# Altium project pcb_kart.PrjPcb
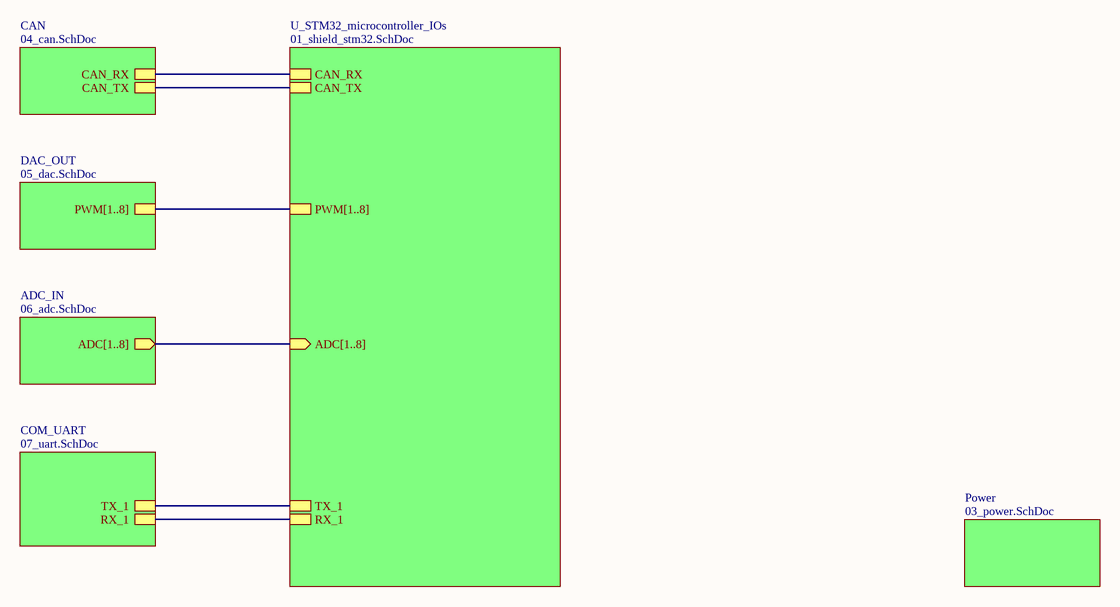
[diagram p0: 00_top.SchDoc]
9 sheets, 191 parts. Net scope: hierarchical (ports join the sheet entries above them; power ports are global).
Board files: PCB.PcbDoc, shield_kart.PcbDoc
Sheets:
  00_top.SchDoc
    U_STM32_microcontroller_IOs = 01_shield_stm32.SchDoc
    Power = 03_power.SchDoc
    CAN = 04_can.SchDoc
    DAC_OUT = 05_dac.SchDoc
      OPTO1 = opto.SchDoc
      OPTO2 = opto.SchDoc
      OPTO3 = opto.SchDoc
      OPTO4 = opto.SchDoc
      OPTO5 = opto.SchDoc
      OPTO6 = opto.SchDoc
      OPTO7 = opto.SchDoc
      OPTO8 = opto.SchDoc
      FILTER1 = low_filter.SchDoc
      FILTER2 = low_filter.SchDoc
      FILTER3 = low_filter.SchDoc
      FILTER4 = low_filter.SchDoc
      FILTER5 = low_filter.SchDoc
      FILTER6 = low_filter.SchDoc
      FILTER7 = low_filter.SchDoc
      FILTER8 = low_filter.SchDoc
    ADC_IN = 06_adc.SchDoc
      OPTO1 = opto.SchDoc
      OPTO2 = opto.SchDoc
      OPTO3 = opto.SchDoc
      OPTO4 = opto.SchDoc
      OPTO5 = opto.SchDoc
      OPTO6 = opto.SchDoc
      OPTO7 = opto.SchDoc
      OPTO8 = opto.SchDoc
      FILTER1 = low_filter.SchDoc
      FILTER2 = low_filter.SchDoc
      FILTER3 = low_filter.SchDoc
      FILTER4 = low_filter.SchDoc
      FILTER5 = low_filter.SchDoc
      FILTER6 = low_filter.SchDoc
      FILTER7 = low_filter.SchDoc
      FILTER8 = low_filter.SchDoc
    COM_UART = 07_uart.SchDoc

## Sheet 00_top.SchDoc: KART : Top
size A4; DrawnBy: JNieto; DocumentNumber: 1; Revision: 1.0; SheetNumber: 1; SheetTotal: 10; Version: V 1.0.0

### Sub-sheets
ADC_IN = 06_adc.SchDoc: ADC[1..8] (out)
CAN = 04_can.SchDoc: CAN_RX, CAN_TX
COM_UART = 07_uart.SchDoc: TX_1, RX_1
DAC_OUT = 05_dac.SchDoc: PWM[1..8]
Power = 03_power.SchDoc: no entries
U_STM32_microcontroller_IOs = 01_shield_stm32.SchDoc: CAN_RX, CAN_TX, PWM[1..8], ADC[1..8] (in), TX_1, RX_1

### Nets
GPS_RX: sheet U_STM32_microcontroller_IOs/RX_1, sheet COM_UART/RX_1
GPS_TX: sheet U_STM32_microcontroller_IOs/TX_1, sheet COM_UART/TX_1
PD0: sheet U_STM32_microcontroller_IOs/CAN_RX, sheet CAN/CAN_RX
PD1: sheet U_STM32_microcontroller_IOs/CAN_TX, sheet CAN/CAN_TX

### Buses and harness runs
bus sheet ADC_IN/ADC[1..8] = sheet U_STM32_microcontroller_IOs/ADC[1..8]
bus sheet DAC_OUT/PWM[1..8] = sheet U_STM32_microcontroller_IOs/PWM[1..8]

## Sheet 01_shield_stm32.SchDoc: KART : SHIELD STM32
size A4; DrawnBy: JNieto; DocumentNumber: 2; Revision: 1.0; SheetNumber: 2; SheetTotal: 10; Version: V 1.0.0
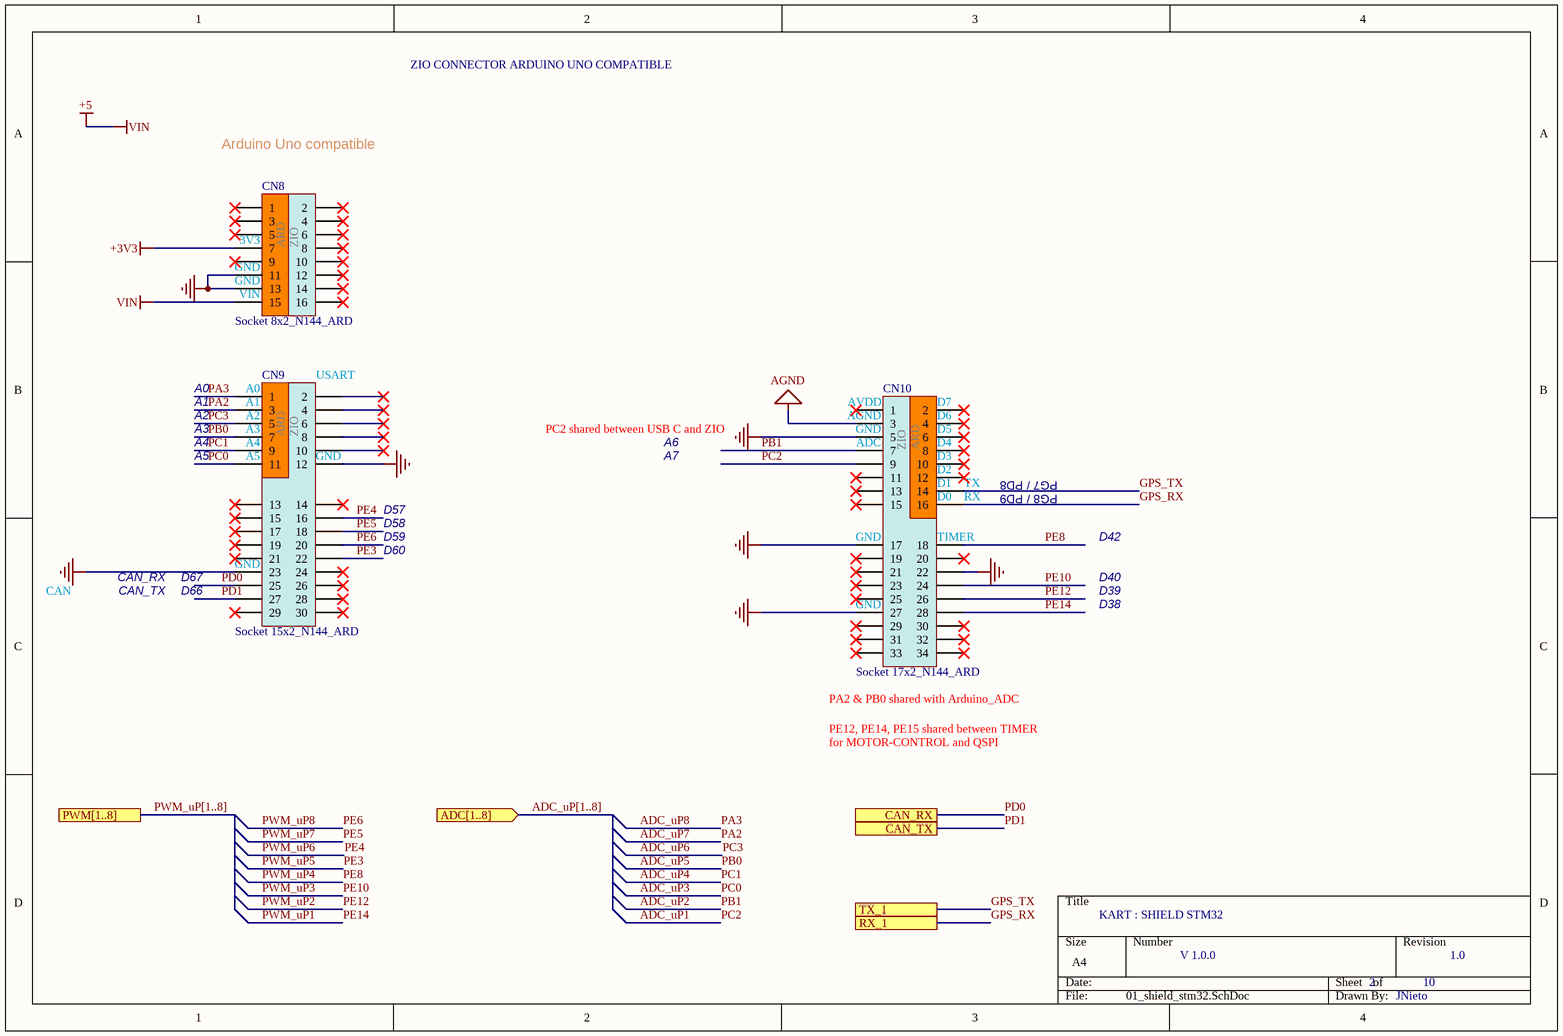
[diagram p1: 01_shield_stm32.SchDoc]

### Parts
CN8  value Socket 8x2_N144_ARD  [CON_SAMTEC_SSW-108-23-X-D_N144_ARD]
CN9  value Socket 15x2_N144_ARD  [CON_SAMTEC_SSW-115-23-X-D_N144_ARD]
CN10  value Socket 17x2_N144_ARD  [CON_SAMTEC_SSW-117-23-X-D_N144_ARD]

### Ports
ADC[1..8] (in), CAN_RX, CAN_TX, PWM[1..8], RX_1, TX_1

### Nets
+3V3: CN8.7
+5: CN8.15  [also labelled VIN]
AGND: CN10.3
GND: CN8.11 CN8.13 CN9.12 CN9.23 CN10.5 CN10.17 CN10.22 CN10.27
ADC_uP1: CN10.9  [also labelled PC2]  [project net ADC_OUT1]
ADC_uP2: CN10.7  [also labelled PB1]  [project net ADC_OUT2]
ADC_uP3: CN9.11  [also labelled PC0]  [project net ADC_OUT3]
ADC_uP4: CN9.9  [also labelled PC1]  [project net ADC_OUT4]
ADC_uP5: CN9.7  [also labelled PB0]  [project net ADC_OUT5]
ADC_uP6: CN9.5  [also labelled PC3]  [project net ADC_OUT6]
ADC_uP7: CN9.3  [also labelled PA2]  [project net ADC_OUT7]
ADC_uP8: CN9.1  [also labelled PA3]  [project net ADC_OUT8]
GPS_RX: CN10.16 ; port RX_1
GPS_TX: CN10.14 ; port TX_1
PD0: CN9.25 ; port CAN_RX
PD1: CN9.27 ; port CAN_TX
PE3: CN9.22  [also labelled PWM_uP5]
PE4: CN9.16  [also labelled PWM_uP6]
PE5: CN9.18  [also labelled PWM_uP7]
PE6: CN9.20  [also labelled PWM_uP8]
PE8: CN10.18  [also labelled PWM_uP4]
PE10: CN10.24  [also labelled PWM_uP3]
PE12: CN10.26  [also labelled PWM_uP2]
PE14: CN10.28  [also labelled PWM_uP1]

Not connected (* = marked no-connect by the designer): CN8 1* 2* 3* 4* 5* 6* 8* 9* 10* 12* 14* 16*; CN9 2* 4* 6* 8* 10* 13* 14* 15* 17* 19* 21* 24* 26* 28* 29* 30*; CN10 1* 2* 4* 6* 8* 10* 11* 12* 13* 15* 19* 20* 21* 23* 25* 29* 30* 31* 32* 33* 34*

### Buses and harness runs
bus ADC_uP[1..8] = port ADC[1..8]
bus PWM_uP[1..8] = port PWM[1..8]

### Notes on the sheet
- ZIO CONNECTOR ARDUINO UNO COMPATIBLE
- Arduino Uno compatible
- (near CN8) 3V3
- (near CN8) GND
- (near CN8) VIN
- (near CN9) USART
- A0
- A1
- A2
- A3
- A4
- (near CN9) A0
- (near CN9) A1
- (near CN9) A2
- (near CN9) A3
- (near CN9) A4
- PC2 shared between USB C and ZIO
- A6
- (near CN10) GND
- (near CN10) AVDD
- (near CN10) AGND
- (near CN10) ADC
- (near CN10) D7
- (near CN10) D6
- (near CN10) D5
- (near CN10) D4
- A5
- (near CN9) A5
- (near CN9) GND
- D57
- A7
- (near CN10) D2
- (near CN10) D3
- (near CN10) D1
- (near CN10) D0
- (near CN10) TX
- (near CN10) RX
- PG8 / PD9
- PG7 / PD8
- CAN_RX
- D67
- D58
- D59
- D60
- (near CN10) TIMER
- D40
- D42
- CAN
- CAN_TX
- D66
- D38
- D39
- (near CN10) PA2 & PB0 shared with Arduino_ADC
- PE12, PE14, PE15 shared between TIMER for MOTOR-CONTROL and QSPI
- (in symbol MCD-01037) ARD; ZIO
- (in symbol MCD-01040) ARD; ZIO
- (in symbol MCD-01041) ZIO; ARD

### Library data of the parts
CN8 = MCD-01037: Socket, 8x2, 2.54mm, VR, TH, Height 8.51mm/10mm, Low insertion force.; Part_Type: Connector; Manufacturer_Part_Number: SSW-108-23-x-D; Manufacturer: SAMTEC; Provided_By: Subcon; Initial_Board_Reference: MB1361; Remark: Socket dedicated to Arduino+ZIO connector on NUCLEO144; Internal_Part_Number: MCD-01037; Status: Checked; ComponentLink1Description: Datasheet; ComponentLink1URL: http://tunmcdsvn.tun.st.com/Component_Datasheet_Library/Trunk/Connectors/Samtec_SSW-SSQ-series; ECCN_US: n/a; ECCN_EU: n/a
CN9 = MCD-01040: Socket, 15x2, 2.54mm, VR, TH, Height 8.51mm/10mm, Low insertion force.; Part_Type: Connector; Manufacturer_Part_Number: SSW-115-23-x-D; Manufacturer: SAMTEC; Provided_By: Subcon; Initial_Board_Reference: MB1361; Remark: Socket dedicated to Arduino+ZIO connector on NUCLEO144; Internal_Part_Number: MCD-01040; Status: Checked; ComponentLink1Description: Datasheet; ComponentLink1URL: http://tunmcdsvn.tun.st.com/Component_Datasheet_Library/Trunk/Connectors/Samtec_SSW-SSQ-series; ECCN_US: n/a; ECCN_EU: n/a
CN10 = MCD-01041: Socket, 17x2, 2.54mm, VR, TH, Height 8.51mm/10mm, Low insertion force; Part_Type: Connector; Manufacturer_Part_Number: SSW-117-23-x-D; Manufacturer: SAMTEC; Provided_By: Subcon; Initial_Board_Reference: MB1361; Remark: Socket dedicated to Arduino+ZIO connector on NUCLEO144; Internal_Part_Number: MCD-01041; Status: Checked; ComponentLink1Description: Datasheet; ComponentLink1URL: http://tunmcdsvn.tun.st.com/Component_Datasheet_Library/Trunk/Connectors/Samtec_SSW-SSQ-series; ECCN_US: n/a; ECCN_EU: n/a

## Sheet 03_power.SchDoc: KART : POWER
size A4; DrawnBy: JNieto; DocumentNumber: 4; Revision: 1.0; SheetNumber: 4; SheetTotal: 10; Version: V 1.0.0
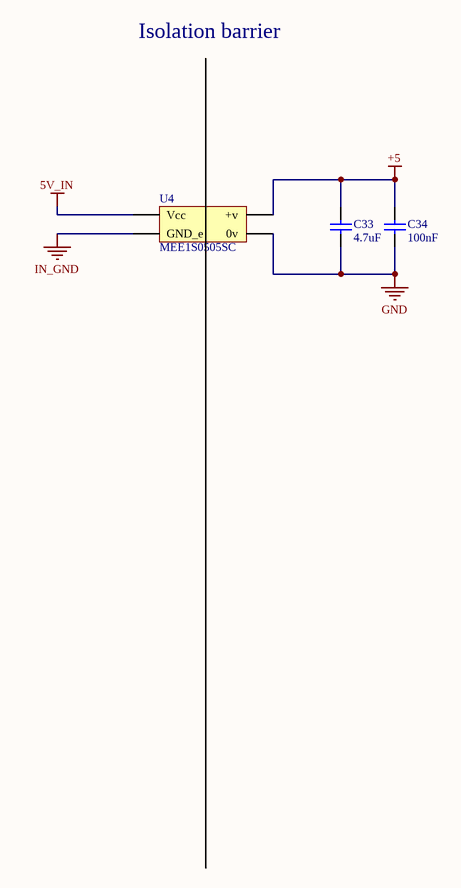
[diagram p2: 03_power.SchDoc]

### Parts
C33  value 4.7uF  [C0402]
C34  value 100nF  [C0603]  (hidden comment: Capacitor)
U4  MEE1S0505SC  [DCDC]

### Nets
5V_IN: U4.2(Vcc)
+5: C33.2 C34.2 U4.4(+v)
GND: C33.1 C34.1 U4.3(0v)
IN_GND: U4.1(GND_e)

### Notes on the sheet
- Isolation barrier

### Library data of the parts
C33 = MCD-01356: Capacitor, MLCC, 4.7uF, 6V3, X5R, 20%, 0402, T=0,5mm; Manufacturer_Part_Number: GRM155R60J475ME47; Manufacturer: MURATA; ECCN_US: EAR99; ECCN_EU: NEC; Provided_By: Subcon; Initial_Board_Reference: MB1372; Internal_Part_Number: MCD-01356; Status: Checked; Part_Type: Capacitor; Package: C0402; ComponentLink1Description: Datasheet; ComponentLink1URL: http://tunmcdsvn.tun.st.com/Component_Datasheet_Library/Trunk/Capacitors/Murata_Capacitor_GR_series
C34 = MCD-00102: Capacitor, MLCC, 100nF, 16V, X7R, 10%, 0402, T=0,5mm; Manufacturer_Part_Number: CC0402KRX7R7BB104; Manufacturer: YAGEO; Alternate_Manufacturer_Part_Number: GCM155R71C104KA55D; Alternate_Manufacturer: MURATA; Provided_By: SUBCO; Internal_Part_Number: MCD-00102; Status: Released; Part_Type: Capacitor; Package: C0402; ComponentLink1Description: Datasheet; ComponentLink1URL: http://tunmcdsvn.tun.st.com/Component_Datasheet_Library/Trunk/Capacitors/Yageo_Multilayer_Capacitor_X7R_series_100pF_to_22uF
U4 = DCDC

## Sheet 04_can.SchDoc: KART : CAN
size A4; DrawnBy: JNieto; DocumentNumber: 4; Revision: 1.0; SheetNumber: 5; SheetTotal: 10; Version: V 1.0.0
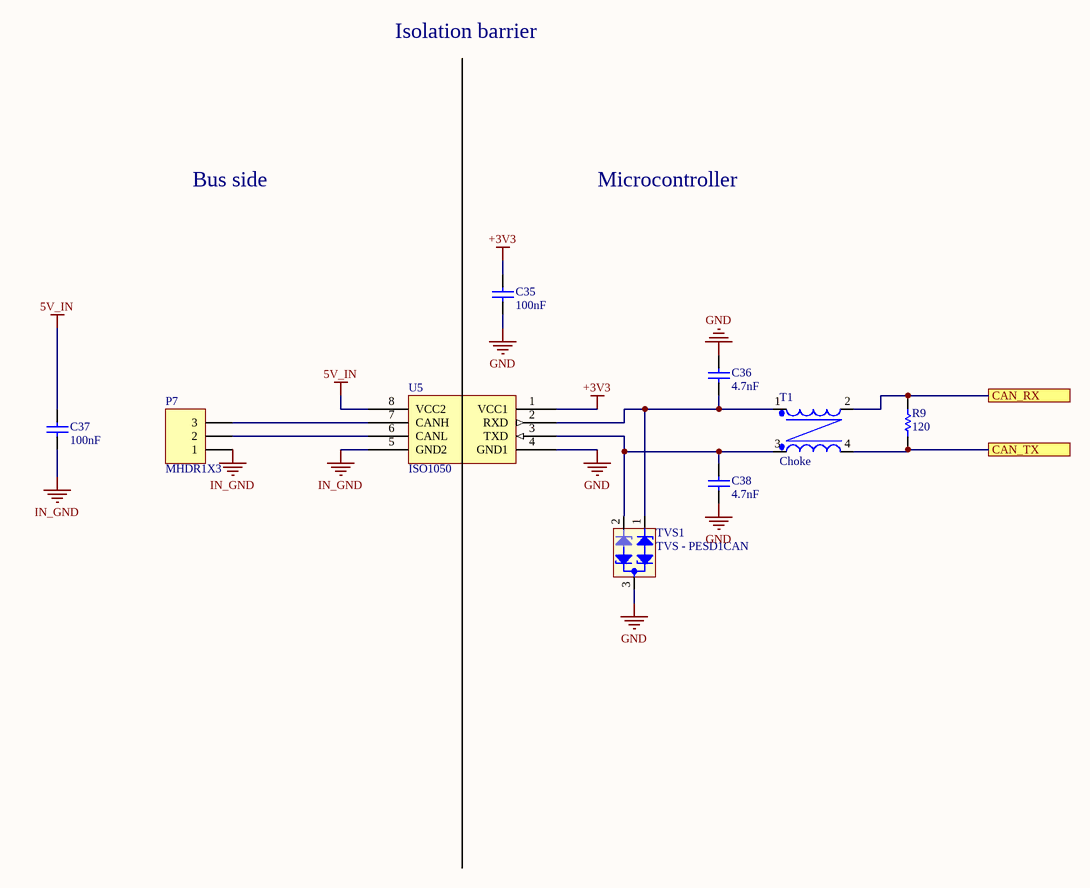
[diagram p3: 04_can.SchDoc]

### Parts
C35  value 100nF  [C0603]  (hidden comment: Capacitor)
C36  value 4.7nF  [C0603]  (hidden comment: Capacitor)
C37  value 100nF  [C0603]  (hidden comment: Capacitor)
C38  value 4.7nF  [C0603]  (hidden comment: Capacitor)
P7  MHDR1X3  [MHDR1X3]
R9  value 120  [R0603]
T1  Choke  [Choke 744232601 Wurth - Footprint Fabricante]
TVS1  TVS - PESD1CAN  [SOT23A]
U5  ISO1050  [ISO1050]

### Ports
CAN_RX, CAN_TX

### Nets
5V_IN: C37.2 U5.8(VCC2)
+3V3: C35.2 U5.1(VCC1)
GND: C35.1 C36.2 C38.1 TVS1.3(Common_Cathode) U5.4(GND1)
IN_GND: C37.1 P7.1 U5.5(GND2)
PD0: R9.1 T1.2(Sec+) ; port CAN_RX
PD1: R9.2 T1.4(Sec-) ; port CAN_TX
NetC36_1: C36.1 T1.1(Pri+) TVS1.1(Cathode) U5.2(RXD)
NetC38_2: C38.2 T1.3(Pri-) TVS1.2(Cathode) U5.3(TXD)
NetP7_2: P7.2 U5.6(CANL)
NetP7_3: P7.3 U5.7(CANH)

### Notes on the sheet
- Isolation barrier
- Bus side
- Microcontroller

### Library data of the parts
C35 C37 = MCD-00010: Capacitor, MLCC, 100nF, 16V, X5R, 10%, 0603, T=0,8mm; Manufacturer_Part_Number: CC0603KRX5R7BB105; Manufacturer: YAGEO; Provided_By: SUBCO; Internal_Part_Number: MCD-00010; Status: Released; Part_Type: Capacitor; Package: C0603; ComponentLink1Description: Datasheet; ComponentLink1URL: http://tunmcdsvn.tun.st.com/Component_Datasheet_Library/Trunk/Capacitors/Yageo_Multilayer_capacitor_X5R_series_100pF_to_100uF
C36 C38 = MCD-00102: Capacitor, MLCC, 4.7nF, 16V, X7R, 10%, 0402, T=0,5mm; Manufacturer_Part_Number: CC0402KRX7R7BB104; Manufacturer: YAGEO; Alternate_Manufacturer_Part_Number: GCM155R71C104KA55D; Alternate_Manufacturer: MURATA; Provided_By: SUBCO; Internal_Part_Number: MCD-00102; Status: Released; Part_Type: Capacitor; Package: C0402; ComponentLink1Description: Datasheet; ComponentLink1URL: http://tunmcdsvn.tun.st.com/Component_Datasheet_Library/Trunk/Capacitors/Yageo_Multilayer_Capacitor_X7R_series_100pF_to_22uF
P7 = MHDR1X3: Header, 3-Pin; LatestRevisionDate: 17-Jul-2002; LatestRevisionNote: Re-released for DXP Platform.; Publisher: Altium Limited
R9 = MCD-00220: Resistor,120,0603,1%,1/10W; Manufacturer_Part_Number: RC0603FR-0710KL; Manufacturer: YAGEO; Provided_By: Subcon; Initial_Board_Reference: MB1319; Internal_Part_Number: MCD-00220; Status: Released; Part_Type: Resistor; ComponentLink1Description: Datasheet; ECCN_US: n/a; ECCN_EU: n/a; Package: R0603; ComponentLink1URL: http://tunmcdsvn.tun.st.com/Component_Datasheet_Library/Trunk/Resistors/Yageo_Resistor_RC0603-series
T1 = Choke_1: Choke modo comun; Dist. 1: FARNELL; Dist. 1 Codigo: 1636477
TVS1 = TVS - PESD1CAN: CAN bus ESD protection diode; Dist. 1 Codigo: 1510703; Dist. 1: FARNELL
U5 = ISO1050: CAN Transceiver, Isolated, Vcc1 - 3 to 5V, Vcc2 - 5V; Precio: 4.09; Dist. 1: Farnell; Dist. 1 Codigo: 1755712; Codigo fabricante: ISO1050DUBR; Comentario: IC, CAN TRANSCEIVER, ISOLATED, 5V

## Sheet 05_dac.SchDoc: KART : DAC
size A4; DrawnBy: JNieto; DocumentNumber: 4; Revision: 1.0; SheetNumber: 8; SheetTotal: 10; Version: V 1.0.0
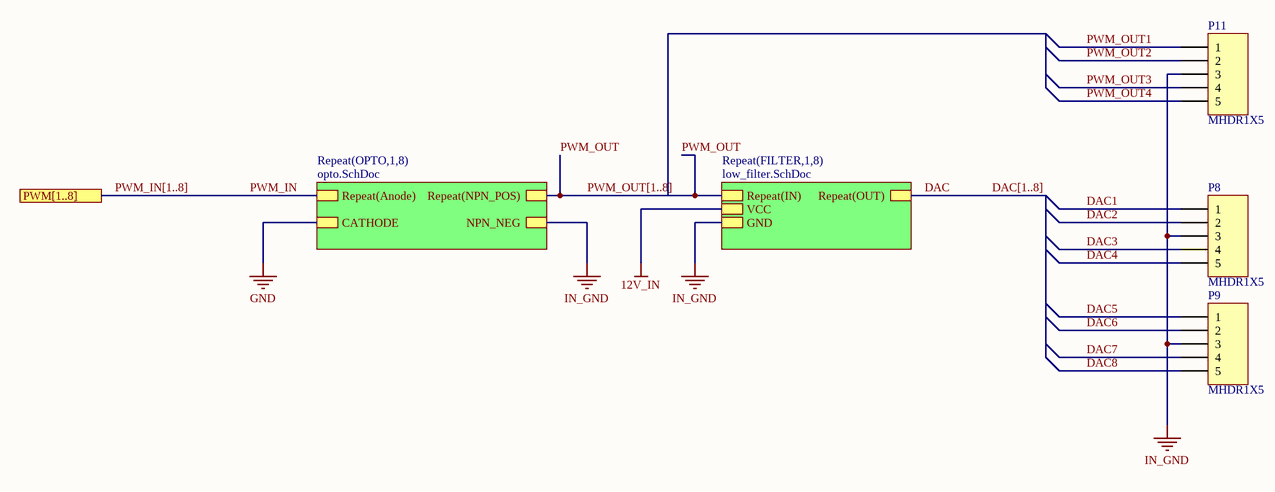
[diagram p4: 05_dac.SchDoc]

### Parts
P8  MHDR1X5  [MHDR1X5]
P9  MHDR1X5  [MHDR1X5]
P11  MHDR1X5  [MHDR1X5]

### Sub-sheets
Repeat(FILTER,1,8) = low_filter.SchDoc: VCC, GND, Repeat(IN), Repeat(OUT)
Repeat(OPTO,1,8) = opto.SchDoc: NPN_NEG, Repeat(NPN_POS), CATHODE, Repeat(Anode)

### Ports
PWM[1..8]

### Nets
IN_GND: P8.3 P9.3 P11.3 ; sheet Repeat(OPTO,1,8)/NPN_NEG, sheet Repeat(FILTER,1,8)/GND
DAC: sheet Repeat(FILTER,1,8)/Repeat(OUT)
DAC1: P8.1
DAC2: P8.2
DAC3: P8.4
DAC4: P8.5
DAC5: P9.1
DAC6: P9.2
DAC7: P9.4
DAC8: P9.5
PWM_IN: sheet Repeat(OPTO,1,8)/Repeat(Anode)
PWM_OUT: sheet Repeat(OPTO,1,8)/Repeat(NPN_POS), sheet Repeat(FILTER,1,8)/Repeat(IN)  [also labelled PWM_OUT[1..8]]
PWM_OUT1: P11.1  [also labelled PWM_OUT[1..8]1]
PWM_OUT2: P11.2  [also labelled PWM_OUT[1..8]2]
PWM_OUT3: P11.4  [also labelled PWM_OUT[1..8]3]
PWM_OUT4: P11.5  [also labelled PWM_OUT[1..8]4]

### Buses and harness runs
bus DAC[1..8]
bus PWM_IN[1..8] = port PWM[1..8]

### Library data of the parts
P8 P9 P11 = MHDR1X5: Header, 5-Pin; LatestRevisionDate: 17-Jul-2002; LatestRevisionNote: Re-released for DXP Platform.; Publisher: Altium Limited

## Sheet opto.SchDoc: KART : FILTER
size A4; DrawnBy: JNieto; DocumentNumber: 4; Revision: 1.0; SheetNumber: 9; SheetTotal: 10; Version: V 1.0.0
Used 16 times, as channels DAC_OUT/OPTO1, DAC_OUT/OPTO2, DAC_OUT/OPTO3, DAC_OUT/OPTO4, DAC_OUT/OPTO5, DAC_OUT/OPTO6, DAC_OUT/OPTO7, DAC_OUT/OPTO8, ADC_IN/OPTO1, ADC_IN/OPTO2, ADC_IN/OPTO3, ADC_IN/OPTO4, ADC_IN/OPTO5, ADC_IN/OPTO6, ADC_IN/OPTO7, ADC_IN/OPTO8. Parts and nets are listed once, with the designators drawn on the sheet.
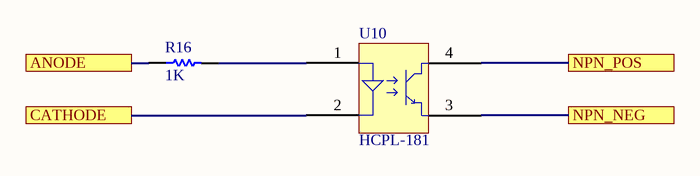
[diagram p5: opto.SchDoc]

### Parts
R16  value 1K  [R0603]
U10  HCPL-181  [SOIC-4]

### Ports
ANODE, CATHODE, NPN_NEG, NPN_POS

### Nets
ANODE: R16.1 ; port ANODE
CATHODE: U10.2 ; port CATHODE
NPN_NEG: U10.3 ; port NPN_NEG
NPN_POS: U10.4 ; port NPN_POS
NetR16_2: R16.2 U10.1

### Channels
DAC_OUT/OPTO1: designators end in _1; ports ANODE=PE14 CATHODE=GND NPN_NEG=IN_GND NPN_POS=PWM_OUT1
DAC_OUT/OPTO2: designators end in _2; ports ANODE=PE12 CATHODE=GND NPN_NEG=IN_GND NPN_POS=PWM_OUT2
DAC_OUT/OPTO3: designators end in _3; ports ANODE=PE10 CATHODE=GND NPN_NEG=IN_GND NPN_POS=PWM_OUT3
DAC_OUT/OPTO4: designators end in _4; ports ANODE=PE8 CATHODE=GND NPN_NEG=IN_GND NPN_POS=PWM_OUT4
DAC_OUT/OPTO5: designators end in _5; ports ANODE=PE3 CATHODE=GND NPN_NEG=IN_GND NPN_POS=PWM_OUT5
DAC_OUT/OPTO6: designators end in _6; ports ANODE=PE4 CATHODE=GND NPN_NEG=IN_GND NPN_POS=PWM_OUT6
DAC_OUT/OPTO7: designators end in _7; ports ANODE=PE5 CATHODE=GND NPN_NEG=IN_GND NPN_POS=PWM_OUT7
DAC_OUT/OPTO8: designators end in _8; ports ANODE=PE6 CATHODE=GND NPN_NEG=IN_GND NPN_POS=PWM_OUT8
ADC_IN/OPTO1: designators end in _9; ports ANODE=ADC1 CATHODE=IN_GND NPN_NEG=AGND NPN_POS=ADC_IN1
ADC_IN/OPTO2: designators end in _10; ports ANODE=ADC2 CATHODE=IN_GND NPN_NEG=AGND NPN_POS=ADC_IN2
ADC_IN/OPTO3: designators end in _11; ports ANODE=ADC3 CATHODE=IN_GND NPN_NEG=AGND NPN_POS=ADC_IN3
ADC_IN/OPTO4: designators end in _12; ports ANODE=ADC4 CATHODE=IN_GND NPN_NEG=AGND NPN_POS=ADC_IN4
ADC_IN/OPTO5: designators end in _13; ports ANODE=ADC5 CATHODE=IN_GND NPN_NEG=AGND NPN_POS=ADC_IN5
ADC_IN/OPTO6: designators end in _14; ports ANODE=ADC6 CATHODE=IN_GND NPN_NEG=AGND NPN_POS=ADC_IN6
ADC_IN/OPTO7: designators end in _15; ports ANODE=ADC7 CATHODE=IN_GND NPN_NEG=AGND NPN_POS=ADC_IN7
ADC_IN/OPTO8: designators end in _16; ports ANODE=ADC8 CATHODE=IN_GND NPN_NEG=AGND NPN_POS=ADC_IN8

### Library data of the parts
R16 = MCD-00220: Resistor,1K,0603,1%,1/10W; Manufacturer_Part_Number: RC0603FR-0710KL; Manufacturer: YAGEO; Provided_By: Subcon; Initial_Board_Reference: MB1319; Internal_Part_Number: MCD-00220; Status: Released; Part_Type: Resistor; ComponentLink1Description: Datasheet; ECCN_US: n/a; ECCN_EU: n/a; Package: R0603; ComponentLink1URL: http://tunmcdsvn.tun.st.com/Component_Datasheet_Library/Trunk/Resistors/Yageo_Resistor_RC0603-series
U10 = HCPL-181: Optoacoplador

## Sheet low_filter.SchDoc: KART : LOW FILTER
size A4; DrawnBy: JNieto; DocumentNumber: 4; Revision: 1.0; SheetNumber: 7; SheetTotal: 10; Version: V 1.0.0
Used 16 times, as channels DAC_OUT/FILTER1, DAC_OUT/FILTER2, DAC_OUT/FILTER3, DAC_OUT/FILTER4, DAC_OUT/FILTER5, DAC_OUT/FILTER6, DAC_OUT/FILTER7, DAC_OUT/FILTER8, ADC_IN/FILTER1, ADC_IN/FILTER2, ADC_IN/FILTER3, ADC_IN/FILTER4, ADC_IN/FILTER5, ADC_IN/FILTER6, ADC_IN/FILTER7, ADC_IN/FILTER8. Parts and nets are listed once, with the designators drawn on the sheet.
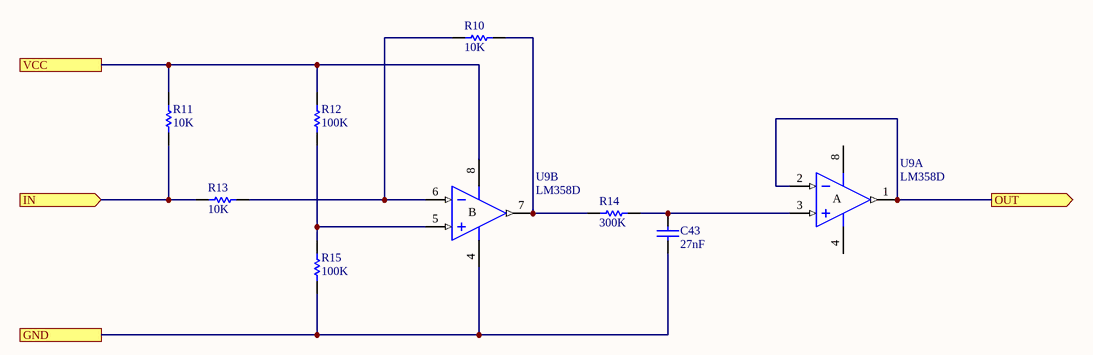
[diagram p6: low_filter.SchDoc]

### Parts
C43  value 27nF  [C0603]
R10  value 10K  [R0603]
R11  value 10K  [R0603]
R12  value 100K  [R0603]
R13  value 10K  [R0603]
R14  value 300K  [R0603]
R15  value 100K  [R0603]
U9  LM358D  [SO8_N]  (parts A,B of 2)

### Ports
GND, IN (in), OUT (out), VCC

### Nets
GND: C43.1 R15.2 U9.4(V-) ; port GND
IN: R11.2 R13.1 ; port IN
OUT: U9.1(OUT) U9.2(IN-) ; port OUT
VCC: R11.1 R12.1 U9.8(V+) ; port VCC
NetC43_2: C43.2 R14.2 U9.3(IN+)
NetR10_1: R10.1 R13.2 U9.6(IN-)
NetR10_2: R10.2 R14.1 U9.7(OUT)
NetR12_2: R12.2 R15.1 U9.5(IN+)

### Channels
DAC_OUT/FILTER1: designators end in _1; ports GND=IN_GND IN=PWM_OUT1 OUT=DAC1 VCC=12V_IN
DAC_OUT/FILTER2: designators end in _2; ports GND=IN_GND IN=PWM_OUT2 OUT=DAC2 VCC=12V_IN
DAC_OUT/FILTER3: designators end in _3; ports GND=IN_GND IN=PWM_OUT3 OUT=DAC3 VCC=12V_IN
DAC_OUT/FILTER4: designators end in _4; ports GND=IN_GND IN=PWM_OUT4 OUT=DAC4 VCC=12V_IN
DAC_OUT/FILTER5: designators end in _5; ports GND=IN_GND IN=PWM_OUT5 OUT=DAC5 VCC=12V_IN
DAC_OUT/FILTER6: designators end in _6; ports GND=IN_GND IN=PWM_OUT6 OUT=DAC6 VCC=12V_IN
DAC_OUT/FILTER7: designators end in _7; ports GND=IN_GND IN=PWM_OUT7 OUT=DAC7 VCC=12V_IN
DAC_OUT/FILTER8: designators end in _8; ports GND=IN_GND IN=PWM_OUT8 OUT=DAC8 VCC=12V_IN
ADC_IN/FILTER1: designators end in _9; ports GND=AGND IN=ADC_IN1 OUT=ADC_OUT1 VCC=+3V3
ADC_IN/FILTER2: designators end in _10; ports GND=AGND IN=ADC_IN2 OUT=ADC_OUT2 VCC=+3V3
ADC_IN/FILTER3: designators end in _11; ports GND=AGND IN=ADC_IN3 OUT=ADC_OUT3 VCC=+3V3
ADC_IN/FILTER4: designators end in _12; ports GND=AGND IN=ADC_IN4 OUT=ADC_OUT4 VCC=+3V3
ADC_IN/FILTER5: designators end in _13; ports GND=AGND IN=ADC_IN5 OUT=ADC_OUT5 VCC=+3V3
ADC_IN/FILTER6: designators end in _14; ports GND=AGND IN=ADC_IN6 OUT=ADC_OUT6 VCC=+3V3
ADC_IN/FILTER7: designators end in _15; ports GND=AGND IN=ADC_IN7 OUT=ADC_OUT7 VCC=+3V3
ADC_IN/FILTER8: designators end in _16; ports GND=AGND IN=ADC_IN8 OUT=ADC_OUT8 VCC=+3V3

### Notes on the sheet
- (in symbol LM358D, part A) A
- (in symbol LM358D, part B) B

### Library data of the parts
C43 = MCD-00211: Capacitor, MLCC, 27nF, 16V, X7R, 10%, 0603, T=0,8mm; Manufacturer_Part_Number: CC0603KRX7R7BB104; Manufacturer: YAGEO; Provided_By: Subcon; Initial_Board_Reference: MB1319; Internal_Part_Number: MCD-00211; ECCN_US: n/a; ECCN_EU: n/a; ComponentLink1Description: Datasheet; Status: Released; Part_Type: Capacitor; Package: C0603; ComponentLink1URL: http://tunmcdsvn.tun.st.com/Component_Datasheet_Library/Trunk/Capacitors/Yageo_Multilayer_Capacitor_X7R_series_100pF_to_22uF
R10 R11 R13 = MCD-00220: Resistor,10K,0603,1%,1/10W; Manufacturer_Part_Number: RC0603FR-0710KL; Manufacturer: YAGEO; Provided_By: Subcon; Initial_Board_Reference: MB1319; Internal_Part_Number: MCD-00220; Status: Released; Part_Type: Resistor; ComponentLink1Description: Datasheet; ECCN_US: n/a; ECCN_EU: n/a; Package: R0603; ComponentLink1URL: http://tunmcdsvn.tun.st.com/Component_Datasheet_Library/Trunk/Resistors/Yageo_Resistor_RC0603-series
R12 R15 = MCD-00220: Resistor,100K,0603,1%,1/10W; Manufacturer_Part_Number: RC0603FR-0710KL; Manufacturer: YAGEO; Provided_By: Subcon; Initial_Board_Reference: MB1319; Internal_Part_Number: MCD-00220; Status: Released; Part_Type: Resistor; ComponentLink1Description: Datasheet; ECCN_US: n/a; ECCN_EU: n/a; Package: R0603; ComponentLink1URL: http://tunmcdsvn.tun.st.com/Component_Datasheet_Library/Trunk/Resistors/Yageo_Resistor_RC0603-series
R14 = MCD-00220: Resistor,300K,0603,1%,1/10W; Manufacturer_Part_Number: RC0603FR-0710KL; Manufacturer: YAGEO; Provided_By: Subcon; Initial_Board_Reference: MB1319; Internal_Part_Number: MCD-00220; Status: Released; Part_Type: Resistor; ComponentLink1Description: Datasheet; ECCN_US: n/a; ECCN_EU: n/a; Package: R0603; ComponentLink1URL: http://tunmcdsvn.tun.st.com/Component_Datasheet_Library/Trunk/Resistors/Yageo_Resistor_RC0603-series
U9 = LM358D: Dual Low-Power Operational Amplifier; Published: 24-Aug-2001; LatestRevisionDate: 13-Apr-2006; LatestRevisionNote: IPC-7351 Footprint Added.; PackageVersion: Dec-2002; PackageReference: SO8; Publisher: Altium Limited; PackageDescription: 8-Pin Small Outline Integrated Circuit 1.27 mm Pitch; Code_JEDEC: MS-012-AA; Code_IPC: SOIC127P600-8; ComponentLink1Description: Manufacturer Link; ComponentLink1URL: http://www.st.com/; ComponentLink2Description: Datasheet; ComponentLink2URL: http://www.st.com/stonline/products/literature/ds/2163/lm358.pdf

## Sheet 06_adc.SchDoc: KART : ADC
size A4; DrawnBy: JNieto; DocumentNumber: 4; Revision: 1.0; SheetNumber: 6; SheetTotal: 10; Version: V 1.0.0
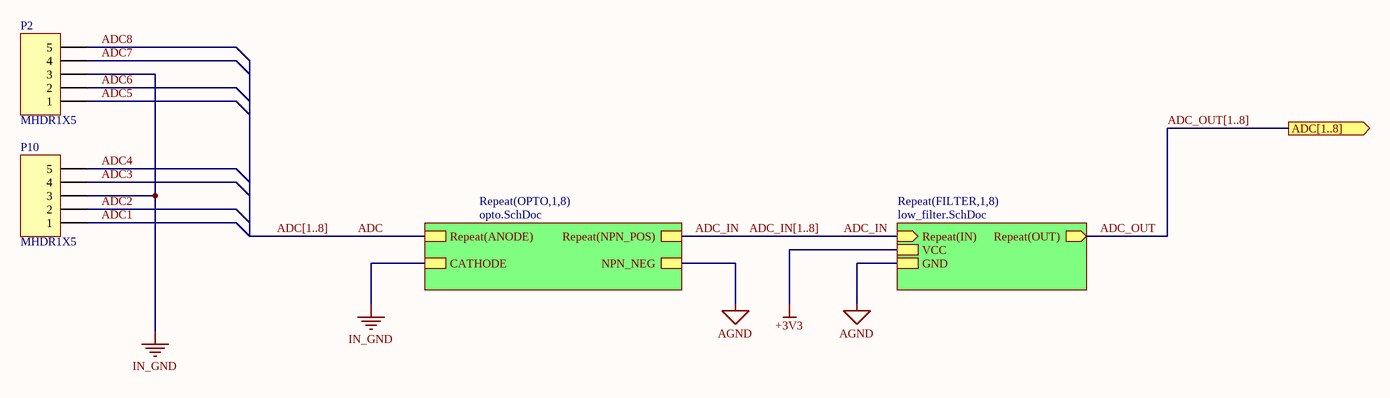
[diagram p7: 06_adc.SchDoc]

### Parts
P2  MHDR1X5  [MHDR1X5]
P10  MHDR1X5  [MHDR1X5]

### Sub-sheets
Repeat(FILTER,1,8) = low_filter.SchDoc: VCC, GND, Repeat(IN) (in), Repeat(OUT) (out)
Repeat(OPTO,1,8) = opto.SchDoc: NPN_NEG, Repeat(NPN_POS), CATHODE, Repeat(ANODE)

### Ports
ADC[1..8] (out)

### Nets
AGND: sheet Repeat(OPTO,1,8)/NPN_NEG, sheet Repeat(FILTER,1,8)/GND
IN_GND: P2.3 P10.3 ; sheet Repeat(OPTO,1,8)/CATHODE
ADC: sheet Repeat(OPTO,1,8)/Repeat(ANODE)
ADC1: P10.1
ADC2: P10.2
ADC3: P10.4
ADC4: P10.5
ADC5: P2.1
ADC6: P2.2
ADC7: P2.4
ADC8: P2.5
ADC_IN: sheet Repeat(OPTO,1,8)/Repeat(NPN_POS), sheet Repeat(FILTER,1,8)/Repeat(IN)
ADC_OUT: sheet Repeat(FILTER,1,8)/Repeat(OUT)

### Buses and harness runs
bus ADC[1..8]
bus ADC_IN[1..8]
bus ADC_OUT[1..8] = port ADC[1..8]

### Library data of the parts
P2 P10 = MHDR1X5: Header, 5-Pin; LatestRevisionDate: 17-Jul-2002; LatestRevisionNote: Re-released for DXP Platform.; Publisher: Altium Limited

## Sheet 07_uart.SchDoc: KART : UART
size A4; DrawnBy: JNieto; DocumentNumber: 4; Revision: 1.0; SheetNumber: 10; SheetTotal: 10; Version: V 1.0.0
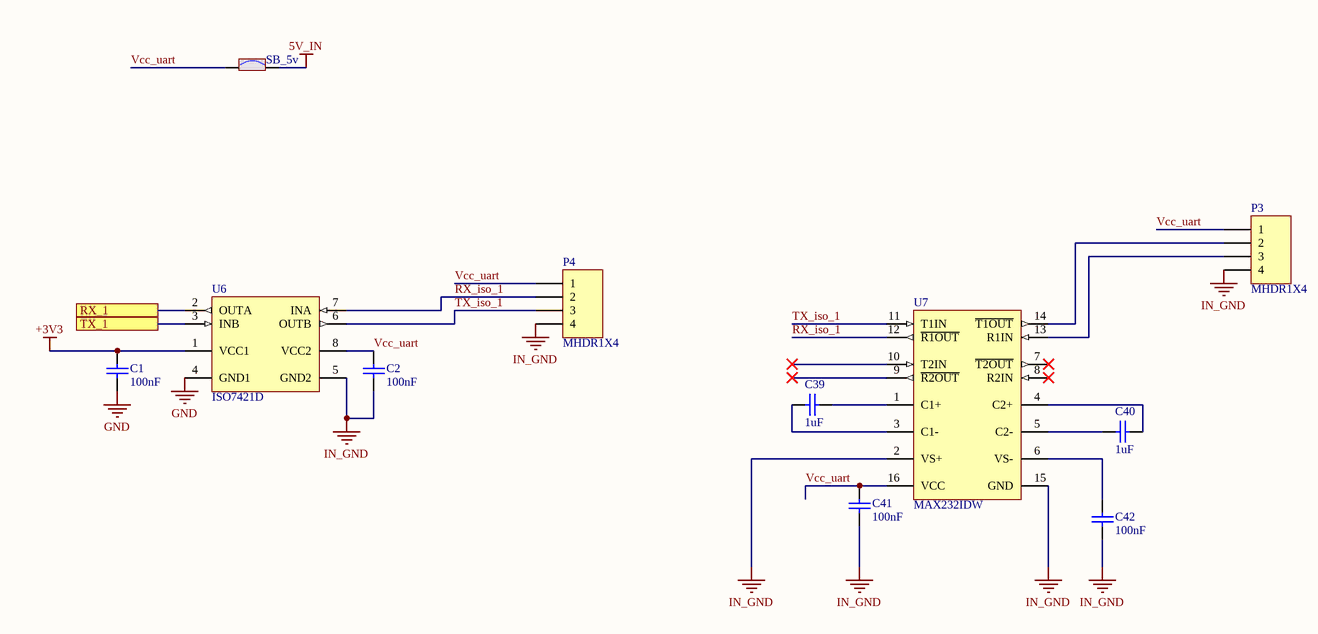
[diagram p8: 07_uart.SchDoc]

### Parts
C1  value 100nF  [C0603]  (hidden comment: Capacitor)
C2  value 100nF  [C0603]  (hidden comment: Capacitor)
C39  value 1uF  [C0603]
C40  value 1uF  [C0603]
C41  value 100nF  [C0603]  (hidden comment: Capacitor)
C42  value 100nF  [C0603]  (hidden comment: Capacitor)
P3  MHDR1X4  [MHDR1X4]
P4  MHDR1X4  [MHDR1X4]
SB_5v  (no value)  [SOLDER-BRIDGE_R0603-0R]
U6  ISO7421D  [D0008A_N]
U7  MAX232IDW  [TI-DW16_N]

### Ports
RX_1, TX_1

### Nets
5V_IN: SB_5v.2
+3V3: C1.2 U6.1(VCC1)
GND: C1.1 U6.4(GND1)
IN_GND: C2.1 C41.1 C42.1 P3.4 P4.4 U6.5(GND2) U7.2(VS+) U7.15(GND)
GPS_RX: U6.2(OUTA) ; port RX_1
GPS_TX: U6.3(INB) ; port TX_1
RX_iso_1: P4.2 U6.7(INA) U7.12(~{R1OUT})
TX_iso_1: P4.3 U6.6(OUTB) U7.11(T1IN)
Vcc_uart: C2.2 C41.2 P3.1 P4.1 SB_5v.1 U6.8(VCC2) U7.16(VCC)
NetC39_1: C39.1 U7.1(C1+)
NetC39_2: C39.2 U7.3(C1-)
NetC40_1: C40.1 U7.5(C2-)
NetC40_2: C40.2 U7.4(C2+)
NetC42_2: C42.2 U7.6(VS-)
NetP3_2: P3.2 U7.14(~{T1OUT})
NetP3_3: P3.3 U7.13(R1IN)

Not connected (* = marked no-connect by the designer): U7 7(~{T2OUT})* 8(R2IN)* 9(~{R2OUT})* 10(T2IN)*

### Library data of the parts
C1 C2 = MCD-00102: as C34 on sheet 03_power; Internal_Part_Number: MCD-00102; Status: Released; Part_Type: Capacitor; Package: C0402; ComponentLink1Description: Datasheet; ComponentLink1URL: http://tunmcdsvn.tun.st.com/Component_Datasheet_Library/Trunk/Capacitors/Yageo_Multilayer_Capacitor_X7R_series_100pF_to_22uF
C39 C40 = MCD-01121: Capacitor, MLCC, 1µF, 10V, X5R, 20%, 0603, T=0,8mm; Manufacturer_Part_Number: GRM188R61A475ME15; Manufacturer: MURATA; ECCN_US: EAR99; ECCN_EU: NEC; Provided_By: Subcon; Initial_Board_Reference: MB1361; Internal_Part_Number: MCD-01121; Status: Released; Part_Type: Capacitor; Package: C0603; ComponentLink1Description: Datasheet; ComponentLink1URL: http://tunmcdsvn.tun.st.com/Component_Datasheet_Library/Trunk/Capacitors/Murata_Capacitor_GR_series
C41 C42 = MCD-00010: as C35 on sheet 04_can; Internal_Part_Number: MCD-00010; Status: Released; Part_Type: Capacitor; Package: C0603; ComponentLink1Description: Datasheet; ComponentLink1URL: http://tunmcdsvn.tun.st.com/Component_Datasheet_Library/Trunk/Capacitors/Yageo_Multilayer_capacitor_X5R_series_100pF_to_100uF
P3 P4 = MHDR1X4: Header, 4-Pin; LatestRevisionDate: 17-Jul-2002; LatestRevisionNote: Re-released for DXP Platform.; Publisher: Altium Limited
SB_5v = MCD-00071: Solder Bridge ON; Part_Type: Mechanical; Provided_By: Subcon; Initial_Board_Reference: MB1274; Internal_Part_Number: MCD-00071; ECCN_US: n/a; ECCN_EU: n/a; Status: Released; ComponentLink1Description: Datasheet
U6 = ISO7421D: 1 Mbps Dual Channels, 1 / 1, Digital Isolator, 3.3 V / 5 V, -40 to +105 degC, 8-pin SOIC (D), Green (RoHS & no Sb/Br); Manufacturer: Texas Instruments; Datarate(Mbps): 1; Input Noise Filter: None; Insulation Rating(VRMS): 2500; Prop Delay(Max)(ns): 12; Rating: Catalog; Supply Voltage(s)(V): 3.3, 5; TTL/CMOS Input Threshold: TTL; DatasheetVersion: SLLS984E; PackageVersion: 4040047-3/M, 06/2011; PackageReference: D0008A; PackageDescription: 8-Pin Plastic Small Outline, Body 4.9 x 3.9 mm, Pitch 1.27 mm; Supplier 1: Digi-Key; Supplier Part Number 1: 296-25187-5-ND; Supplier 2: Farnell; Supplier Part Number 2: 2335668; Supplier 3: Newark; Supplier Part Number 3: 96W6898; Supplier 4: Newark; Supplier Part Number 4: 33R2484; Supplier 5: Mouser; Supplier Part Number 5: 595-ISO7421D; SubFamily: Isolator; Thermal Shutdown: No; MountType: SMT; Code_JEDEC: MS-012; PartNumber: ISO7421D; ComponentLink1Description: Manufacturer URL; ComponentLink1URL: http://www.ti.com/; ComponentLink2Description: Datasheet; ComponentLink2URL: http://www.ti.com/general/docs/lit/getliterature.tsp?genericPartNumber=ISO7421&fileType=pdf; ComponentLink3Description: Package Specification; ComponentLink3URL: http://www.ti.com/litv/pdf/msoi002j; ComponentLink4Description: SamplesURL; ComponentLink4URL: http://www.ti.com/product/iso7421#samples
U7 = MAX232IDW: Dual EIA-232 Driver / Receiver, -40 to 85 degC, 16-Pin SOIC (DW), Green (RoHS & no Sb/Br); SubFamily: RS-232; Drivers Per Package: 2; Supply Voltage(s)(V): 5; ESD HBM(kV): +/-2; ICC(Max)(mA): 10; Single Supply: TRUE; DatasheetVersion: SLLS047L; PackageVersion: revG, Jan-2011; PackageReference: DW16; PackageDescription: 16-Pin Small Outline Integrated Circuit, 10.3 x 7.5 mm, Pitch 1.27 mm Pitch; Receivers Per Package: 2; RS-232: TRUE; ComponentLink1Description: Manufacturer URL; ComponentLink1URL: www.ti.com; ComponentLink2Description: Datasheet; ComponentLink2URL: http://www.ti.com/general/docs/lit/getliterature.tsp?genericPartNumber=MAX232&fileType=pdf; ComponentLink3Description: Package Specification; ComponentLink3URL: http://www.ti.com/litv/pdf/msoi003g

## Nets that join several sheets
5V_IN: 03_power (U4.2), 04_can (C37.2 U5.8), 07_uart (SB_5v.2)
12V_IN: DAC_OUT/FILTER1 (R11_1.1 R12_1.1 U9_1.8), DAC_OUT/FILTER2 (R11_2.1 R12_2.1 U9_2.8), DAC_OUT/FILTER3 (R11_3.1 R12_3.1 U9_3.8), DAC_OUT/FILTER4 (R11_4.1 R12_4.1 U9_4.8), DAC_OUT/FILTER5 (R11_5.1 R12_5.1 U9_5.8), DAC_OUT/FILTER6 (R11_6.1 R12_6.1 U9_6.8), DAC_OUT/FILTER7 (R11_7.1 R12_7.1 U9_7.8), DAC_OUT/FILTER8 (R11_8.1 R12_8.1 U9_8.8)
+3V3: 01_shield_stm32 (CN8.7), 04_can (C35.2 U5.1), ADC_IN/FILTER1 (R11_9.1 R12_9.1 U9_9.8), ADC_IN/FILTER2 (R11_10.1 R12_10.1 U9_10.8), ADC_IN/FILTER3 (R11_11.1 R12_11.1 U9_11.8), ADC_IN/FILTER4 (R11_12.1 R12_12.1 U9_12.8), ADC_IN/FILTER5 (R11_13.1 R12_13.1 U9_13.8), ADC_IN/FILTER6 (R11_14.1 R12_14.1 U9_14.8), ADC_IN/FILTER7 (R11_15.1 R12_15.1 U9_15.8), ADC_IN/FILTER8 (R11_16.1 R12_16.1 U9_16.8), 07_uart (C1.2 U6.1)
+5: 01_shield_stm32 (CN8.15), 03_power (C33.2 C34.2 U4.4)
AGND: 01_shield_stm32 (CN10.3), ADC_IN/OPTO1 (U10_9.3), ADC_IN/OPTO2 (U10_10.3), ADC_IN/OPTO3 (U10_11.3), ADC_IN/OPTO4 (U10_12.3), ADC_IN/OPTO5 (U10_13.3), ADC_IN/OPTO6 (U10_14.3), ADC_IN/OPTO7 (U10_15.3), ADC_IN/OPTO8 (U10_16.3), ADC_IN/FILTER1 (C43_9.1 R15_9.2 U9_9.4), ADC_IN/FILTER2 (C43_10.1 R15_10.2 U9_10.4), ADC_IN/FILTER3 (C43_11.1 R15_11.2 U9_11.4), ADC_IN/FILTER4 (C43_12.1 R15_12.2 U9_12.4), ADC_IN/FILTER5 (C43_13.1 R15_13.2 U9_13.4), ADC_IN/FILTER6 (C43_14.1 R15_14.2 U9_14.4), ADC_IN/FILTER7 (C43_15.1 R15_15.2 U9_15.4), ADC_IN/FILTER8 (C43_16.1 R15_16.2 U9_16.4)
GND: 01_shield_stm32 (8 pins), 03_power (C33.1 C34.1 U4.3), 04_can (5 pins), DAC_OUT/OPTO1 (U10_1.2), DAC_OUT/OPTO2 (U10_2.2), DAC_OUT/OPTO3 (U10_3.2), DAC_OUT/OPTO4 (U10_4.2), DAC_OUT/OPTO5 (U10_5.2), DAC_OUT/OPTO6 (U10_6.2), DAC_OUT/OPTO7 (U10_7.2), DAC_OUT/OPTO8 (U10_8.2), 07_uart (C1.1 U6.4)
IN_GND: 03_power (U4.1), 04_can (C37.1 P7.1 U5.5), 05_dac (P8.3 P9.3 P11.3), DAC_OUT/OPTO1 (U10_1.3), DAC_OUT/OPTO2 (U10_2.3), DAC_OUT/OPTO3 (U10_3.3), DAC_OUT/OPTO4 (U10_4.3), DAC_OUT/OPTO5 (U10_5.3), DAC_OUT/OPTO6 (U10_6.3), DAC_OUT/OPTO7 (U10_7.3), DAC_OUT/OPTO8 (U10_8.3), DAC_OUT/FILTER1 (C43_1.1 R15_1.2 U9_1.4), DAC_OUT/FILTER2 (C43_2.1 R15_2.2 U9_2.4), DAC_OUT/FILTER3 (C43_3.1 R15_3.2 U9_3.4), DAC_OUT/FILTER4 (C43_4.1 R15_4.2 U9_4.4), DAC_OUT/FILTER5 (C43_5.1 R15_5.2 U9_5.4), DAC_OUT/FILTER6 (C43_6.1 R15_6.2 U9_6.4), DAC_OUT/FILTER7 (C43_7.1 R15_7.2 U9_7.4), DAC_OUT/FILTER8 (C43_8.1 R15_8.2 U9_8.4), 06_adc (P2.3 P10.3), ADC_IN/OPTO1 (U10_9.2), ADC_IN/OPTO2 (U10_10.2), ADC_IN/OPTO3 (U10_11.2), ADC_IN/OPTO4 (U10_12.2), ADC_IN/OPTO5 (U10_13.2), ADC_IN/OPTO6 (U10_14.2), ADC_IN/OPTO7 (U10_15.2), ADC_IN/OPTO8 (U10_16.2), 07_uart (8 pins)
ADC1: 06_adc (P10.1), ADC_IN/OPTO1 (R16_9.1)
ADC2: 06_adc (P10.2), ADC_IN/OPTO2 (R16_10.1)
ADC3: 06_adc (P10.4), ADC_IN/OPTO3 (R16_11.1)
ADC4: 06_adc (P10.5), ADC_IN/OPTO4 (R16_12.1)
ADC5: 06_adc (P2.1), ADC_IN/OPTO5 (R16_13.1)
ADC6: 06_adc (P2.2), ADC_IN/OPTO6 (R16_14.1)
ADC7: 06_adc (P2.4), ADC_IN/OPTO7 (R16_15.1)
ADC8: 06_adc (P2.5), ADC_IN/OPTO8 (R16_16.1)
ADC_IN1: ADC_IN/OPTO1 (U10_9.4), ADC_IN/FILTER1 (R11_9.2 R13_9.1)
ADC_IN2: ADC_IN/OPTO2 (U10_10.4), ADC_IN/FILTER2 (R11_10.2 R13_10.1)
ADC_IN3: ADC_IN/OPTO3 (U10_11.4), ADC_IN/FILTER3 (R11_11.2 R13_11.1)
ADC_IN4: ADC_IN/OPTO4 (U10_12.4), ADC_IN/FILTER4 (R11_12.2 R13_12.1)
ADC_IN5: ADC_IN/OPTO5 (U10_13.4), ADC_IN/FILTER5 (R11_13.2 R13_13.1)
ADC_IN6: ADC_IN/OPTO6 (U10_14.4), ADC_IN/FILTER6 (R11_14.2 R13_14.1)
ADC_IN7: ADC_IN/OPTO7 (U10_15.4), ADC_IN/FILTER7 (R11_15.2 R13_15.1)
ADC_IN8: ADC_IN/OPTO8 (U10_16.4), ADC_IN/FILTER8 (R11_16.2 R13_16.1)
ADC_OUT1: 01_shield_stm32 (CN10.9), ADC_IN/FILTER1 (U9_9.1 U9_9.2)
ADC_OUT2: 01_shield_stm32 (CN10.7), ADC_IN/FILTER2 (U9_10.1 U9_10.2)
ADC_OUT3: 01_shield_stm32 (CN9.11), ADC_IN/FILTER3 (U9_11.1 U9_11.2)
ADC_OUT4: 01_shield_stm32 (CN9.9), ADC_IN/FILTER4 (U9_12.1 U9_12.2)
ADC_OUT5: 01_shield_stm32 (CN9.7), ADC_IN/FILTER5 (U9_13.1 U9_13.2)
ADC_OUT6: 01_shield_stm32 (CN9.5), ADC_IN/FILTER6 (U9_14.1 U9_14.2)
ADC_OUT7: 01_shield_stm32 (CN9.3), ADC_IN/FILTER7 (U9_15.1 U9_15.2)
ADC_OUT8: 01_shield_stm32 (CN9.1), ADC_IN/FILTER8 (U9_16.1 U9_16.2)
DAC1: 05_dac (P8.1), DAC_OUT/FILTER1 (U9_1.1 U9_1.2)
DAC2: 05_dac (P8.2), DAC_OUT/FILTER2 (U9_2.1 U9_2.2)
DAC3: 05_dac (P8.4), DAC_OUT/FILTER3 (U9_3.1 U9_3.2)
DAC4: 05_dac (P8.5), DAC_OUT/FILTER4 (U9_4.1 U9_4.2)
DAC5: 05_dac (P9.1), DAC_OUT/FILTER5 (U9_5.1 U9_5.2)
DAC6: 05_dac (P9.2), DAC_OUT/FILTER6 (U9_6.1 U9_6.2)
DAC7: 05_dac (P9.4), DAC_OUT/FILTER7 (U9_7.1 U9_7.2)
DAC8: 05_dac (P9.5), DAC_OUT/FILTER8 (U9_8.1 U9_8.2)
GPS_RX: 01_shield_stm32 (CN10.16), 07_uart (U6.2)
GPS_TX: 01_shield_stm32 (CN10.14), 07_uart (U6.3)
PD0: 01_shield_stm32 (CN9.25), 04_can (R9.1 T1.2)
PD1: 01_shield_stm32 (CN9.27), 04_can (R9.2 T1.4)
PE3: 01_shield_stm32 (CN9.22), DAC_OUT/OPTO5 (R16_5.1)
PE4: 01_shield_stm32 (CN9.16), DAC_OUT/OPTO6 (R16_6.1)
PE5: 01_shield_stm32 (CN9.18), DAC_OUT/OPTO7 (R16_7.1)
PE6: 01_shield_stm32 (CN9.20), DAC_OUT/OPTO8 (R16_8.1)
PE8: 01_shield_stm32 (CN10.18), DAC_OUT/OPTO4 (R16_4.1)
PE10: 01_shield_stm32 (CN10.24), DAC_OUT/OPTO3 (R16_3.1)
PE12: 01_shield_stm32 (CN10.26), DAC_OUT/OPTO2 (R16_2.1)
PE14: 01_shield_stm32 (CN10.28), DAC_OUT/OPTO1 (R16_1.1)
PWM_OUT1: 05_dac (P11.1), DAC_OUT/OPTO1 (U10_1.4), DAC_OUT/FILTER1 (R11_1.2 R13_1.1)
PWM_OUT2: 05_dac (P11.2), DAC_OUT/OPTO2 (U10_2.4), DAC_OUT/FILTER2 (R11_2.2 R13_2.1)
PWM_OUT3: 05_dac (P11.4), DAC_OUT/OPTO3 (U10_3.4), DAC_OUT/FILTER3 (R11_3.2 R13_3.1)
PWM_OUT4: 05_dac (P11.5), DAC_OUT/OPTO4 (U10_4.4), DAC_OUT/FILTER4 (R11_4.2 R13_4.1)
PWM_OUT5: DAC_OUT/OPTO5 (U10_5.4), DAC_OUT/FILTER5 (R11_5.2 R13_5.1)
PWM_OUT6: DAC_OUT/OPTO6 (U10_6.4), DAC_OUT/FILTER6 (R11_6.2 R13_6.1)
PWM_OUT7: DAC_OUT/OPTO7 (U10_7.4), DAC_OUT/FILTER7 (R11_7.2 R13_7.1)
PWM_OUT8: DAC_OUT/OPTO8 (U10_8.4), DAC_OUT/FILTER8 (R11_8.2 R13_8.1)